# Altium project flight_controller.PrjPcb
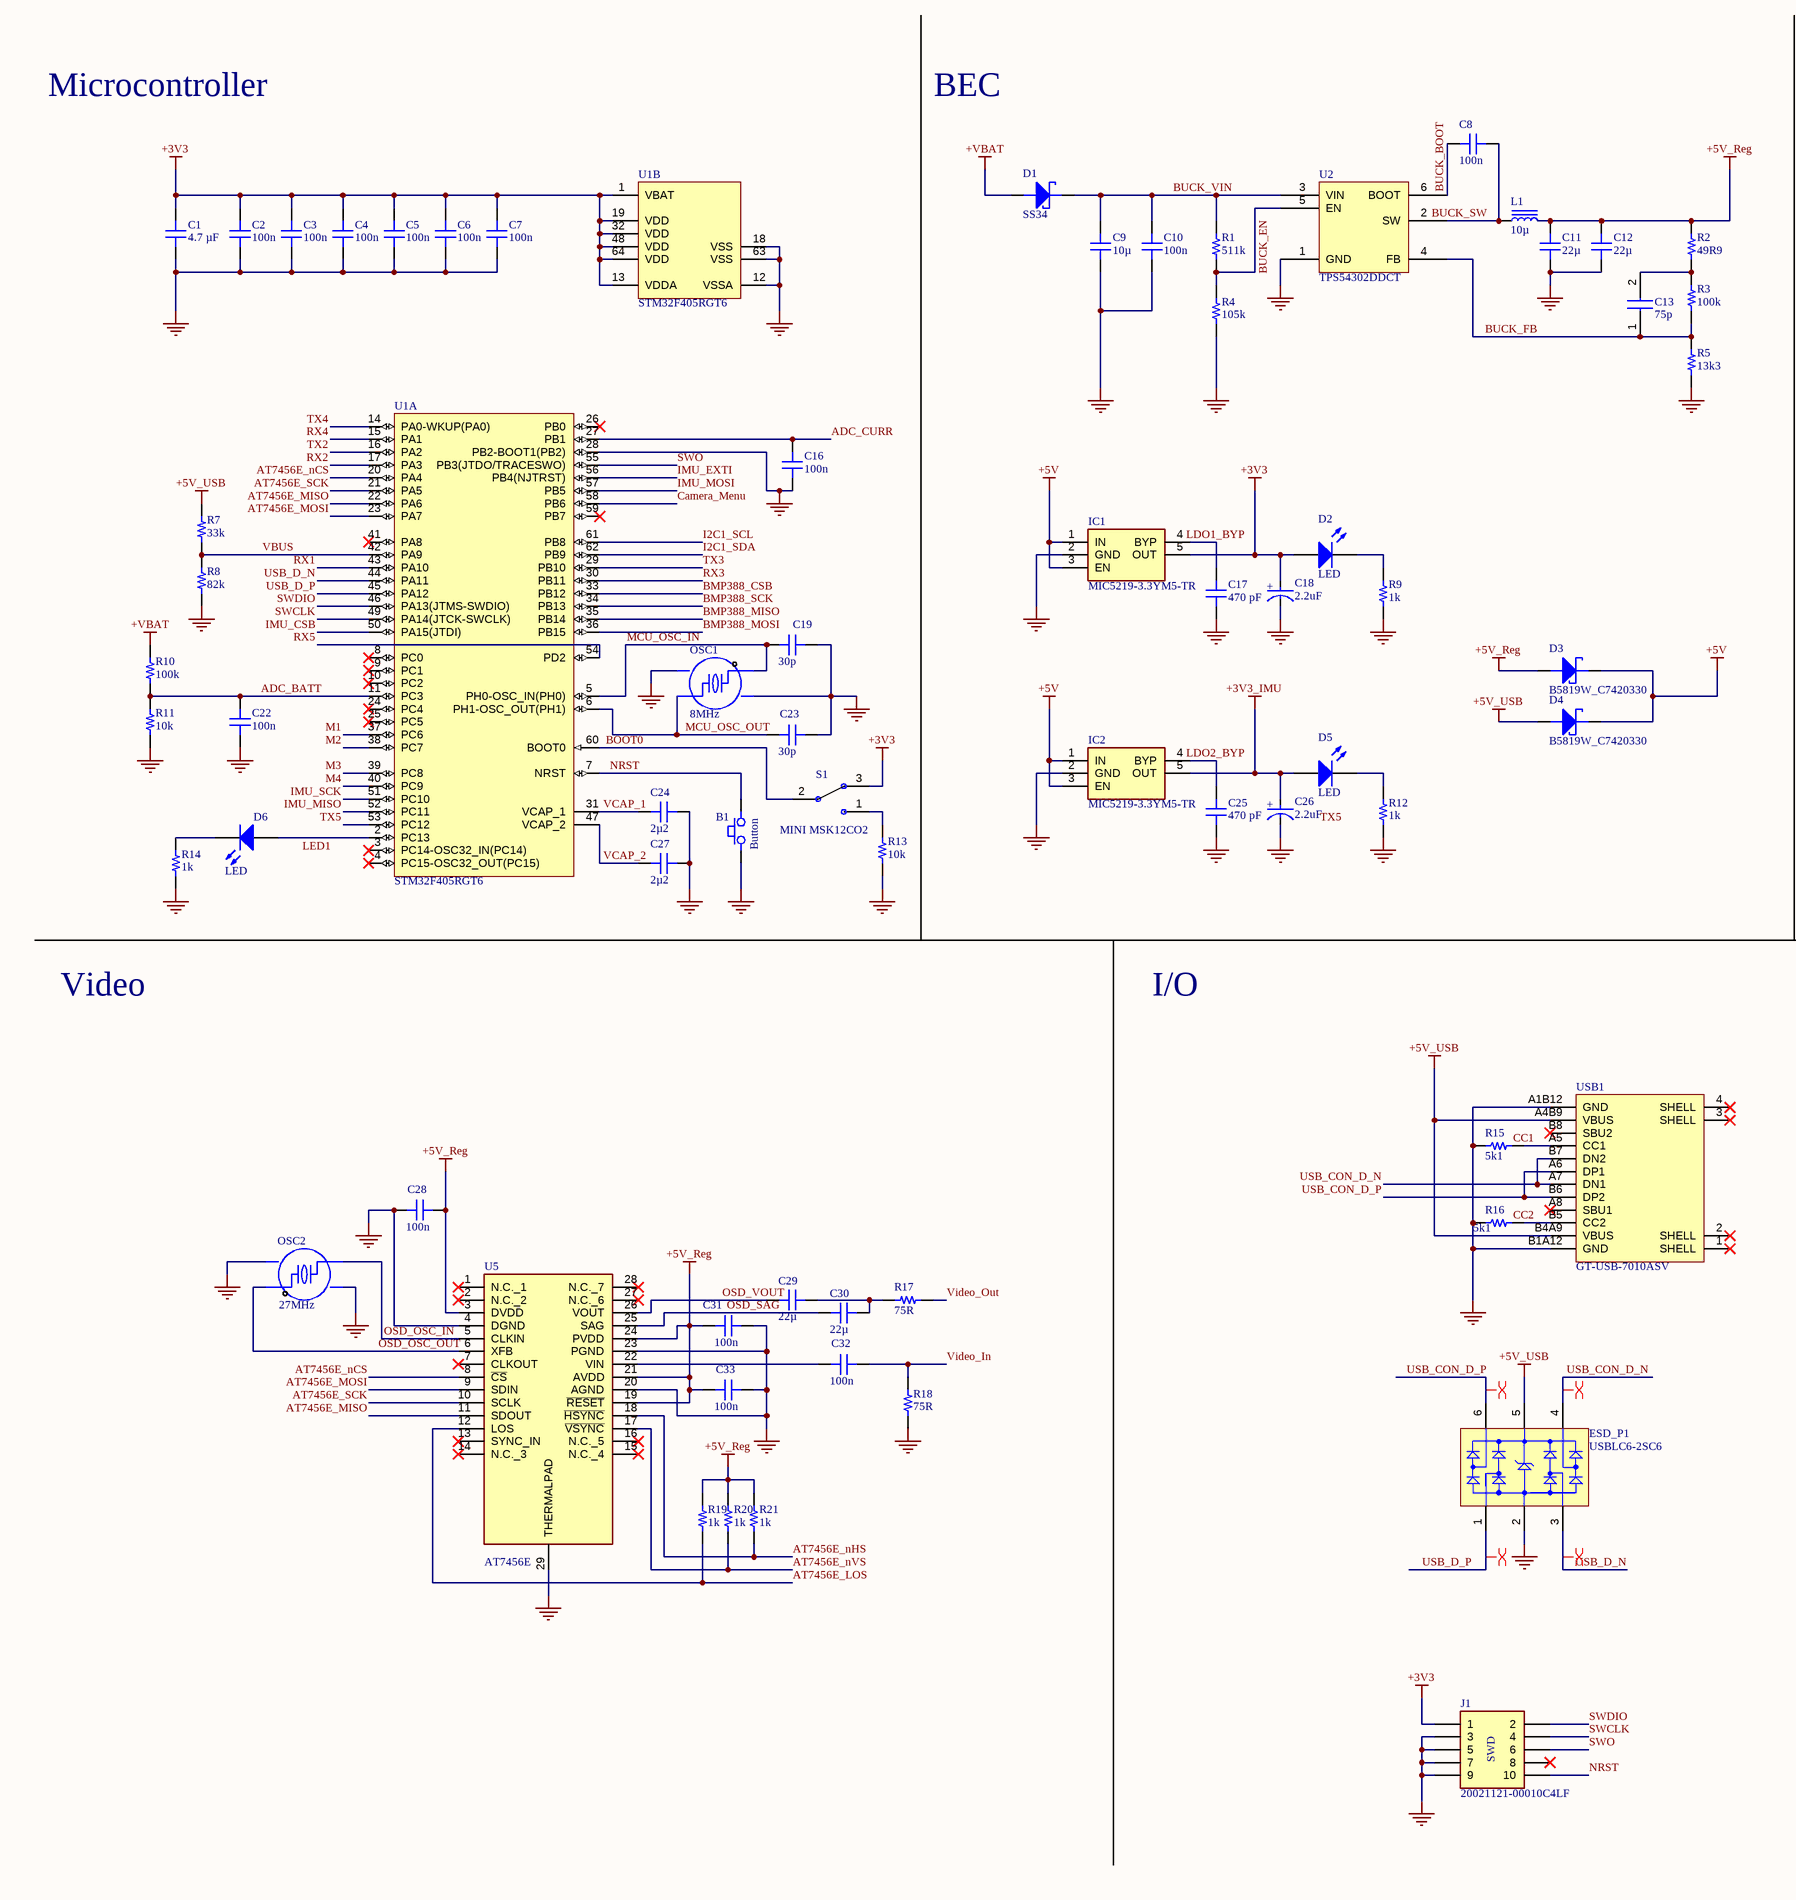
[diagram p0: flight_controller.SchDoc, left]
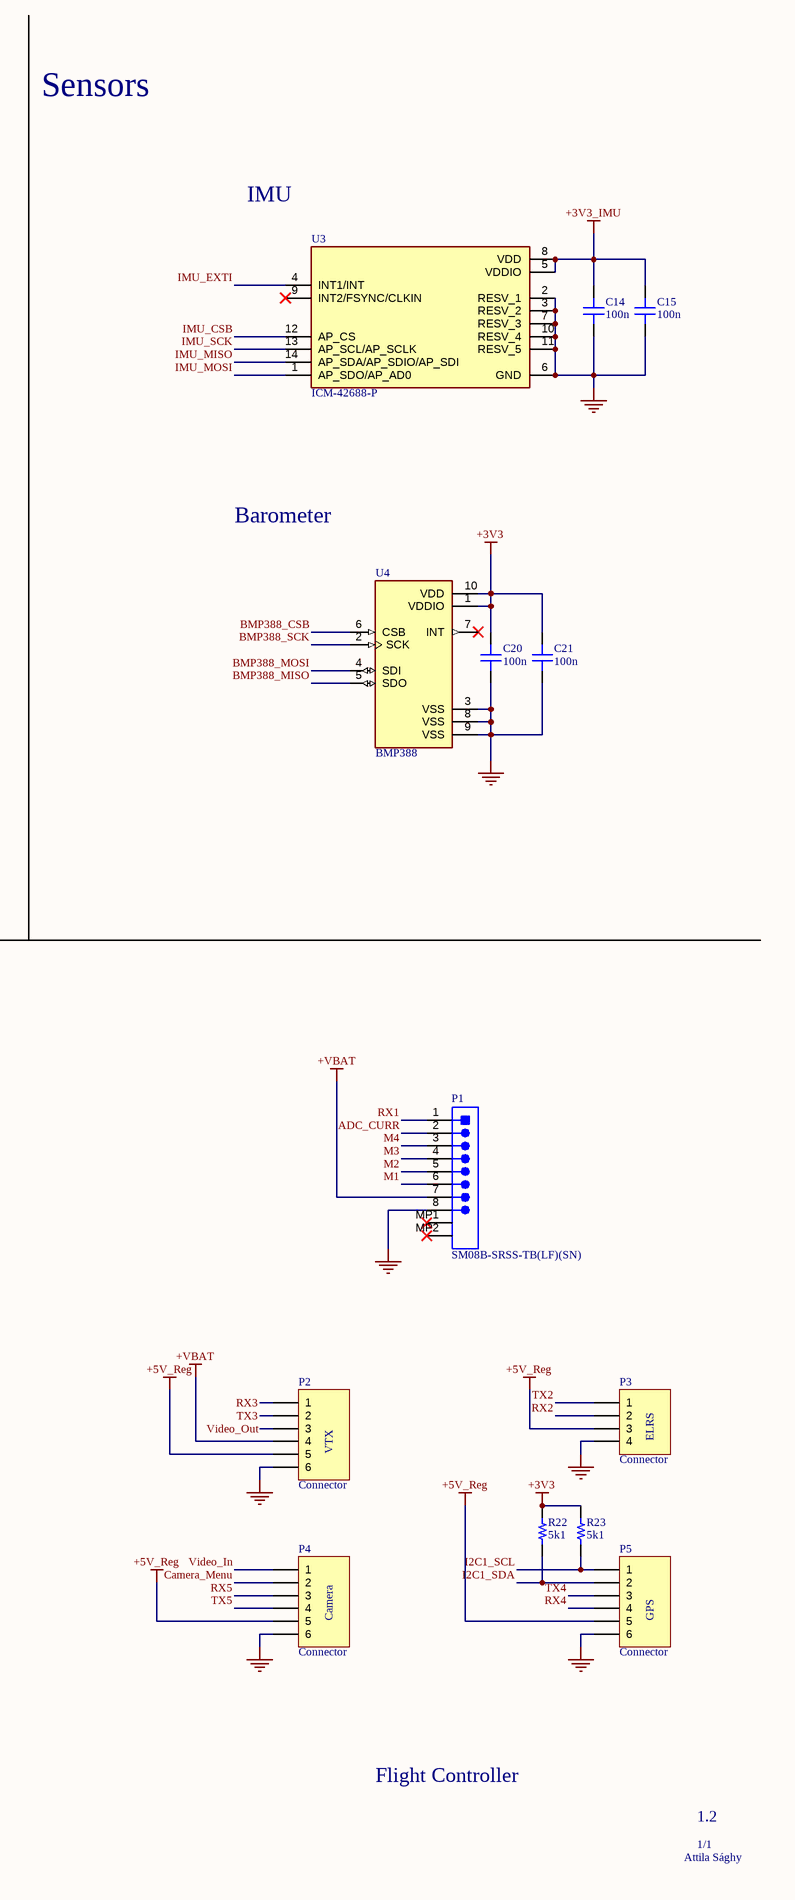
[diagram p1: flight_controller.SchDoc, right]
1 sheet, 81 parts. Net scope: global (net labels, ports and power ports of the same name join across sheets).
Board file: flight_controller.PcbDoc

## Sheet flight_controller.SchDoc
size C; SheetNumber: 1; SheetTotal: 1

### Parts
B1  Button  [TS24CA]
C1  4.7 µF  [CAP 0805_2012]
C2  Capacitance: 100n  [CAP 0603_1608]  (hidden comment: 0.1 µF)
C3  Capacitance: 100n  [CAP 0603_1608]  (hidden comment: 0.1 µF)
C4  Capacitance: 100n  [CAP 0603_1608]  (hidden comment: 0.1 µF)
C5  Capacitance: 100n  [CAP 0603_1608]  (hidden comment: 0.1 µF)
C6  Capacitance: 100n  [CAP 0603_1608]  (hidden comment: 0.1 µF)
C7  Capacitance: 100n  [CAP 0603_1608]  (hidden comment: 0.1 µF)
C8  Capacitance: 100n  [CAP 0603_1608]  (hidden comment: 0.1 µF)
C9  Capacitance: 10µ  [MURATA GRM21B 0805_2012]  (hidden comment: 10 µF)
C10  Capacitance: 100n  [CAP 0603_1608]  (hidden comment: 0.1 µF)
C11  Capacitance: 22µ  [CAP 0805_2012]  (hidden comment: 22 µF)
C12  Capacitance: 22µ  [CAP 0805_2012]  (hidden comment: 22 µF)
C13  75p  [CAPC1608X90N]
C14  Capacitance: 100n  [CAP 0603_1608]  (hidden comment: 0.1 µF)
C15  Capacitance: 100n  [CAP 0603_1608]  (hidden comment: 0.1 µF)
C16  Capacitance: 100n  [CAP 0603_1608]  (hidden comment: 0.1 µF)
C17  Capacitance: 470 pF  [CAP 0805_2012]  (hidden comment: 10 µF)
C18  2.2uF  [FP-TAJA-MFG]
C19  Capacitance: 30p  [CAP 0603_1608]  (hidden comment: 0.1 µF)
C20  Capacitance: 100n  [CAP 0603_1608]  (hidden comment: 0.1 µF)
C21  Capacitance: 100n  [CAP 0603_1608]  (hidden comment: 0.1 µF)
C22  Capacitance: 100n  [CAP 0603_1608]  (hidden comment: 0.1 µF)
C23  Capacitance: 30p  [CAP 0603_1608]  (hidden comment: 0.1 µF)
C24  Capacitance: 2µ2  [CAP 0805_2012]  (hidden comment: 2.2 µF)
C25  Capacitance: 470 pF  [CAP 0805_2012]  (hidden comment: 10 µF)
C26  2.2uF  [FP-TAJA-MFG]
C27  Capacitance: 2µ2  [CAP 0805_2012]  (hidden comment: 2.2 µF)
C28  Capacitance: 100n  [CAP 0603_1608]  (hidden comment: 0.1 µF)
C29  Capacitance: 22µ  [CAP 0805_2012]  (hidden comment: 22 µF)
C30  Capacitance: 22µ  [CAP 0805_2012]  (hidden comment: 22 µF)
C31  Capacitance: 100n  [CAP 0603_1608]  (hidden comment: 0.1 µF)
C32  Capacitance: 100n  [CAP 0603_1608]  (hidden comment: 0.1 µF)
C33  Capacitance: 100n  [CAP 0603_1608]  (hidden comment: 0.1 µF)
D1  SS34  [FP_SMA]
D2  LED  [FP_0805_LED_GREEN]
D3  B5819W_C7420330  [SOD-123]
D4  B5819W_C7420330  [SOD-123]
D5  LED  [FP_0805_LED_GREEN]
D6  LED  [FP_0805_LED_GREEN]
ESD_P1  USBLC6-2SC6  [STM-SOT23-6L_V]
IC1  MIC5219-3.3YM5-TR  [SOT95P280X145-5N]
IC2  MIC5219-3.3YM5-TR  [SOT95P280X145-5N]
J1  20021121-00010C4LF  [2002112100010C4LF]
L1  10µ  [BOURNS SRP5030T]
OSC1  8MHz  [CRYSTAL-SMD_4P-L3.2-W2.5-BL]
OSC2  27MHz  [X322527MSB4SI]
P1  SM08B-SRSS-TB(LF)(SN)  [JST-SM08B-SRSS-TB_V]
P2  Connector  [PAD_6]
P3  Connector  [PAD_4]
P4  Connector  [PAD_6]
P5  Connector  [PAD_6]
R1  511k  [YAGEO RES 0603_1608]
R2  49R9  [YAGEO RES 0603_1608]
R3  100k  [YAGEO RES 0603_1608]
R4  105k  [YAGEO RES 0603_1608]
R5  13k3  [YAGEO RES 0603_1608]
R7  33k  [YAGEO RES 0603_1608]
R8  82k  [YAGEO RES 0603_1608]
R9  1k  [YAGEO RES 0603_1608]
R10  value 100k  [YAGEO RES 0603_1608]  (hidden comment: 33k)
R11  value 10k  [YAGEO RES 0603_1608]  (hidden comment: 6.8k)
R12  1k  [YAGEO RES 0603_1608]
R13  value 10k  [YAGEO RES 0603_1608]  (hidden comment: 6.8k)
R14  1k  [YAGEO RES 0603_1608]
R15  5k1  [YAGEO RES 0603_1608]
R16  5k1  [YAGEO RES 0603_1608]
R17  75R  [YAGEO RES 0603_1608]
R18  75R  [YAGEO RES 0603_1608]
R19  1k  [YAGEO RES 0603_1608]
R20  1k  [YAGEO RES 0603_1608]
R21  1k  [YAGEO RES 0603_1608]
R22  5k1  [YAGEO RES 0603_1608]
R23  5k1  [YAGEO RES 0603_1608]
S1  MINI MSK12CO2  [SW-SMD_MSK12CO2]
U1  STM32F405RGT6  [STM-LQFP64_M]  (parts A,B of 2)
U2  TPS54302DDCT  [TI SOT-23-6 DDC]
U3  ICM-42688-P  [IIM42352]
U4  BMP388  [PQFN50P200X200X80-10N]
U5  AT7456E  [SOP65P640X120-29N]
USB1  GT-USB-7010ASV  [USB-C-SMD_G-SWITCH_GT-USB-7010ASV]

### Nets
+3V3: C1.2 C2.2 C3.2 C4.2 C5.2 C6.2 C7.2 C18.2(A) C20.1 C21.1 D2.1(A) IC1.5(OUT) J1.1 R22.1 R23.1 S1.3 U1.1(VBAT) U1.13(VDDA) U1.19(VDD) U1.32(VDD) U1.48(VDD) U1.64(VDD) U4.1(VDDIO) U4.10(VDD)
+3V3_IMU: C14.1 C15.1 C26.2(A) D5.1(A) IC2.5(OUT) U3.5(VDDIO) U3.8(VDD)
+5V: D3.2(CATHODE) D4.2(CATHODE) IC1.1(IN) IC1.3(EN) IC2.1(IN) IC2.3(EN)
+5V_Reg: C11.2 C12.2 C28.2 C31.1 C33.1 D3.1(ANODE) L1.2 P2.5 P3.3 P4.5 P5.5 R2.2 R19.2 R20.2 R21.2 U5.3(DVDD) U5.19(~{RESET}) U5.21(AVDD) U5.24(PVDD)
+5V_USB: D4.1(ANODE) ESD_P1.5(VBUS) R7.2 USB1.A4B9(VBUS) USB1.B4A9(VBUS)
+VBAT: D1.1(ANODE) P1.7 P2.4 R10.2
GND: B1.1 C1.1 C2.1 C3.1 C4.1 C5.1 C6.1 C7.1 C9.1 C10.2 C11.1 C12.1 C14.2 C15.2 C16.1 C17.1 C18.1(C) C19.1 C20.2 C21.2 C22.1 C23.1 C24.1 C25.1 C26.1(C) C27.1 C28.1 C31.2 C33.2 ESD_P1.2(GND) IC1.2(GND) IC2.2(GND) J1.3 J1.5 J1.7 J1.9 OSC1.2(GND) OSC1.4(GND) OSC2.2(GND) OSC2.4(GND) P1.8 P2.6 P3.4 P4.6 P5.6 R4.1 R5.1 R8.1 R9.1 R11.1 R12.1 R13.1 R14.1 R15.2 R16.2 R18.2 U1.12(VSSA) U1.18(VSS) U1.28(PB2-BOOT1(PB2)) U1.63(VSS) U2.1(GND) U3.2(RESV_1) U3.3(RESV_2) U3.6(GND) U3.7(RESV_3) U3.10(RESV_4) U3.11(RESV_5) U4.3(VSS) U4.8(VSS) U4.9(VSS) U5.4(DGND) U5.20(AGND) U5.23(PGND) U5.29(THERMALPAD) USB1.A1B12(GND) USB1.B1A12(GND)
ADC_BATT: C22.2 R10.1 R11.2 U1.11(PC3)
ADC_CURR: C16.2 P1.2 U1.27(PB1)
AT7456E_LOS: R19.1 U5.12(LOS)
AT7456E_MISO: U1.22(PA6) U5.11(SDOUT)
AT7456E_MOSI: U1.23(PA7) U5.9(SDIN)
AT7456E_nCS: U1.20(PA4) U5.8(~{CS})
AT7456E_nHS: R21.1 U5.18(~{HSYNC})
AT7456E_nVS: R20.1 U5.17(~{VSYNC})
AT7456E_SCK: U1.21(PA5) U5.10(SCLK)
BMP388_CSB: U1.33(PB12) U4.6(CSB)
BMP388_MISO: U1.35(PB14) U4.5(SDO)
BMP388_MOSI: U1.36(PB15) U4.4(SDI)
BMP388_SCK: U1.34(PB13) U4.2(SCK)
BOOT0: S1.2 U1.60(BOOT0)
BUCK_BOOT: C8.1 U2.6(BOOT)
BUCK_EN: R1.1 R4.2 U2.5(EN)
BUCK_FB: C13.1 R3.1 R5.2 U2.4(FB)
BUCK_SW: C8.2 L1.1 U2.2(SW)
BUCK_VIN: C9.2 C10.1 D1.2(CATHODE) R1.2 U2.3(VIN)
Camera_Menu: P4.2 U1.58(PB6)
CC1: R15.1 USB1.A5(CC1)
CC2: R16.1 USB1.B5(CC2)
I2C1_SCL: P5.1 R23.2 U1.61(PB8)
I2C1_SDA: P5.2 R22.2 U1.62(PB9)
IMU_CSB: U1.50(PA15(JTDI)) U3.12(AP_CS)
IMU_EXTI: U1.56(PB4(NJTRST)) U3.4(INT1/INT)
IMU_MISO: U1.52(PC11) U3.14(AP_SDA/AP_SDIO/AP_SDI)
IMU_MOSI: U1.57(PB5) U3.1(AP_SDO/AP_AD0)
IMU_SCK: U1.51(PC10) U3.13(AP_SCL/AP_SCLK)
LDO1_BYP: C17.2 IC1.4(BYP)
LDO2_BYP: C25.2 IC2.4(BYP)
LED1: D6.1(A) U1.2(PC13)
M1: P1.6 U1.37(PC6)
M2: P1.5 U1.38(PC7)
M3: P1.4 U1.39(PC8)
M4: P1.3 U1.40(PC9)
MCU_OSC_IN: C19.2 OSC1.1 U1.5(PH0-OSC_IN(PH0))
MCU_OSC_OUT: C23.2 OSC1.3 U1.6(PH1-OSC_OUT(PH1))
NRST: B1.2 J1.10 U1.7(NRST)
OSD_OSC_IN: OSC2.3 U5.5(CLKIN)
OSD_OSC_OUT: OSC2.1 U5.6(XFB)
OSD_SAG: C30.2 U5.25(SAG)
OSD_VOUT: C29.2 U5.26(VOUT)
RX1: P1.1 U1.43(PA10)
RX2: P3.2 U1.17(PA3)
RX3: P2.1 U1.30(PB11)
RX4: P5.4 U1.15(PA1)
RX5: P4.3 U1.54(PD2)
SWCLK: J1.4 U1.49(PA14(JTCK-SWCLK))
SWDIO: J1.2 U1.46(PA13(JTMS-SWDIO))
SWO: J1.6 U1.55(PB3(JTDO/TRACESWO))
TX2: P3.1 U1.16(PA2)
TX3: P2.2 U1.29(PB10)
TX4: P5.3 U1.14(PA0-WKUP(PA0))
TX5: P4.4 U1.53(PC12)
USB_CON_D_N: ESD_P1.4(I/O_3) USB1.A7(DN1) USB1.B7(DN2)
USB_CON_D_P: ESD_P1.6(I/O_4) USB1.A6(DP1) USB1.B6(DP2)
USB_D_N: ESD_P1.3(I/O_2) U1.44(PA11)
USB_D_P: ESD_P1.1(I/O_1) U1.45(PA12)
VBUS: R7.1 R8.2 U1.42(PA9)
VCAP_1: C24.2 U1.31(VCAP_1)
VCAP_2: C27.2 U1.47(VCAP_2)
Video_In: C32.2 P4.1 R18.1
Video_Out: P2.3 R17.1
NetC13_2: C13.2 R2.1 R3.2
NetC29_1: C29.1 C30.1 R17.2
NetC32_1: C32.1 U5.22(VIN)
NetD2_2: D2.2(K) R9.2
NetD5_2: D5.2(K) R12.2
NetD6_2: D6.2(K) R14.2
NetR13_2: R13.2 S1.1

Not connected (* = marked no-connect by the designer): J1 8*; P1 MP1* MP2*; U1 3(PC14-OSC32_IN(PC14))* 4(PC15-OSC32_OUT(PC15))* 8(PC0)* 9(PC1)* 10(PC2)* 24(PC4)* 25(PC5)* 26(PB0)* 41(PA8)* 59(PB7)*; U3 9(INT2/FSYNC/CLKIN)*; U4 7(INT)*; U5 1(N.C._1)* 2(N.C._2)* 7(CLKOUT)* 13(SYNC_IN)* 14(N.C._3)* 15(N.C._4)* 16(N.C._5)* 27(N.C._6)* 28(N.C._7)*; USB1 1(SHELL)* 2(SHELL)* 3(SHELL)* 4(SHELL)* A8(SBU1)* B8(SBU2)*

### Layout directives
differential pair: USB_CON_D_N, USB_CON_D_P, USB_D_N, USB_D_P

### Notes on the sheet
- Microcontroller
- BEC
- Sensors
- IMU
- Barometer
- Video
- I/O
- (near P2) VTX
- (near P3) ELRS
- (near P4) Camera
- (near P5) GPS
- (near J1) SWD
- Flight Controller
- Attila Sághy
- 1.2
- 1/1
- Labels drawn without touching a wire or pin: TX5
- (in symbol CMP-04424-000432-1) +

### Library data of the parts
B1 = Button 2P: Push button
C1 = CL21A475KAQNNNE: CAP CER 4.7UF 25V X5R 0805; manufacturer: Samsung Electro-Mechanics; Tolerance: ±10%; Part Number: CL21A475KAQNNNE; Capacitance: 4.7 µF; Applications: General Purpose; componentlink1description: Datasheet; componentlink1url: http://www.samsungsem.com/kr/support/product-search/mlcc/CL21A475KAQNNNE.jsp; componentlink2description: DigiKey Link; componentlink2url: https://www.digikey.com/en/products/detail/samsung-electro-mechanics/CL21A475KAQNNNE/3886902; Device Package: 0805 (2012 Metric); lastupdated: 09/02/2024 20:15:37; Lifecycle Status: Active; Minimum Order: 1; Mounting Type: Surface Mount, MLCC; Operating Temperature: -55°C ~ 85°C; Package / Case: 0805 (2012 Metric); packaging: TapeAndReel; partid: 14321; Part Status: Active; price: 0.01; series: CL; Size / Dimension: 0.079" L x 0.049" W (2.00mm x 1.25mm); Supplier 1: DigiKey; Supplier Part Number 1: 1276-1244-1-ND; Temperature Coefficient: X5R; Thickness (Max): 0.055" (1.40mm); value: 4.7 µF; Voltage - Rated: 25V
C2-C8 C10 C14-C16 C19-C23 C28 C31-C33 = CL10B104KB8NNNC: CAP CER 0.1UF 50V X7R 0603; manufacturer: Samsung Electro-Mechanics; Tolerance: ±10%; Part Number: CL10B104KB8NNNC; Applications: General Purpose; componentlink1description: Datasheet; componentlink1url: http://www.samsungsem.com/kr/support/product-search/mlcc/CL10B104KB8NNNC.jsp; componentlink2description: DigiKey Link; componentlink2url: https://www.digikey.com/en/products/detail/samsung-electro-mechanics/CL10B104KB8NNNC/3886658; Device Package: 0603 (1608 Metric); lastupdated: 09/02/2024 20:10:20; Lifecycle Status: Active; Minimum Order: 1; Mounting Type: Surface Mount, MLCC; Operating Temperature: -55°C ~ 125°C; Package / Case: 0603 (1608 Metric); packaging: TapeAndReel; partid: 9788; Part Status: Active; price: 0.01; series: CL; Size / Dimension: 0.063" L x 0.031" W (1.60mm x 0.80mm); Supplier 1: DigiKey; Supplier Part Number 1: 1276-1000-1-ND; Temperature Coefficient: X7R; Thickness (Max): 0.035" (0.90mm); value: 0.1 µF; Voltage - Rated: 50V
C9 = GRM21BR61H106KE43L: CAP CER 10UF 50V X5R 0805; manufacturer: Murata Electronics; Tolerance: ±10%; Part Number: GRM21BR61H106KE43L; Applications: Mobile Devices Only; componentlink1description: Datasheet; componentlink1url: https://search.murata.co.jp/Ceramy/image/img/A01X/G101/ENG/GRM21BR61H106KE43-01A.pdf; componentlink2description: DigiKey Link; componentlink2url: https://www.digikey.com/en/products/detail/murata-electronics/GRM21BR61H106KE43L/10326316; Device Package: 0805 (2012 Metric); lastupdated: 27/08/2024 09:29:56; Lifecycle Status: Active; Minimum Order: 1; Mounting Type: Surface Mount, MLCC; Operating Temperature: -55°C ~ 85°C; Package / Case: 0805 (2012 Metric); packaging: TapeAndReel; partid: 39284; Part Status: Active; price: 0.05; series: GRM; Size / Dimension: 0.079" L x 0.049" W (2.00mm x 1.25mm); Supplier 1: DigiKey; Supplier Part Number 1: 490-18663-1-ND; Temperature Coefficient: X5R; Thickness (Max): 0.057" (1.45mm); VALUE: 10 µF; Voltage - Rated: 50V
C11 C12 C29 C30 = CL21A226KOQNNNE: CAP CER 22UF 16V X5R 0805; manufacturer: Samsung Electro-Mechanics; Tolerance: ±10%; Part Number: CL21A226KOQNNNE; Applications: General Purpose; componentlink1description: Datasheet; componentlink1url: http://www.samsungsem.com/kr/support/library/product-catalog/mlcc.jsp; componentlink2description: DigiKey Link; componentlink2url: https://www.digikey.com/en/products/detail/samsung-electro-mechanics/CL21A226KOQNNNE/5961010; Device Package: 0805 (2012 Metric); lastupdated: 09/02/2024 20:16:07; Lifecycle Status: Active; Minimum Order: 1; Mounting Type: Surface Mount, MLCC; Operating Temperature: -55°C ~ 85°C; Package / Case: 0805 (2012 Metric); packaging: TapeAndReel; partid: 3004; Part Status: Active; price: 0.06; series: CL; Size / Dimension: 0.079" L x 0.049" W (2.00mm x 1.25mm); Supplier 1: DigiKey; Supplier Part Number 1: 1276-6526-1-ND; Temperature Coefficient: X5R; Thickness (Max): 0.055" (1.40mm); value: 22 µF; Voltage - Rated: 16V
C13 = 0603CG750J500NT: Capacitor; Manufacturer_Name: FH(Guangdong Fenghua Advanced Tech); Datasheet Link: https://datasheet.lcsc.com/lcsc/1811061811_FH--Guangdong-Fenghua-Advanced-Tech-0603CG750J500NT_C1681.pdf; Height: 0.9mm; Manufacturer_Part_Number: 0603CG750J500NT
C17 C25 = CL10B471KB8NNNC: CAP CER 470PF 50V X7R 0603; manufacturer: Samsung Electro-Mechanics; Tolerance: ±10%; Part Number: CL10B471KB8NNNC; Applications: General Purpose; componentlink1description: Datasheet; componentlink1url: http://www.samsungsem.com/kr/support/product-search/mlcc/CL10B471KB8NNNC.jsp; componentlink2description: DigiKey Link; componentlink2url: https://www.digikey.com/en/products/detail/samsung-electro-mechanics/CL10B471KB8NNNC/3886752; Device Package: 0603 (1608 Metric); lastupdated: 09/02/2024 20:10:20; Lifecycle Status: Active; Minimum Order: 1; Mounting Type: Surface Mount, MLCC; Operating Temperature: -55°C ~ 125°C; Package / Case: 0603 (1608 Metric); packaging: TapeAndReel; partid: 9822; Part Status: Active; price: 0.01; series: CL; Size / Dimension: 0.063" L x 0.031" W (1.60mm x 0.80mm); Supplier 1: DigiKey; Supplier Part Number 1: 1276-1094-1-ND; Temperature Coefficient: X7R; Thickness (Max): 0.035" (0.90mm); value: 470 pF; Voltage - Rated: 50V
C18 C26 = CMP-04424-000432-1: TAJA225K016RNJ 2.2uF 16V  ±10% 6.5Ω 1206  SMD Tantalum Capacitor; Polarity: Polar; Leakage Current: 500nA; Dissipation Factor: 6%; ESR (Equivalent Series Resistance): 6.5R; Q Factor: 6; Series: TAJ; Number of Pins: 2; Termination: SMD/SMT; Construction: Flat; Min Operating Temperature: -55°C; Capacitance: 2.2uF; Voltage Rating: 16V; Dielectric Material: Tantalum; Radiation Hardening: No; Package Quantity: 1; Depth: 1.6mm; Features: General Purpose; Max Operating Temperature: 125°C; Height: 1.6mm; Height - Seated (Max): 0.071inch; Tolerance: 10%; Voltage Rating (DC): 16V; Width: 1.6mm; Mount: Surface Mount; Packaging: Tape and Reel; Lead Free: Lead Free; RoHS Compliant: Yes; Length: 3.2mm; Case/Package: 1206; REACH SVHC: No SVHC; Case Code (Metric): 3216; Case Code (Imperial): 1206; Voltage: 16V
C24 C27 = CL21B225KAFNNNE: CAP CER 2.2UF 25V X7R 0805; manufacturer: Samsung Electro-Mechanics; Tolerance: ±10%; Part Number: CL21B225KAFNNNE; Applications: General Purpose; componentlink1description: Datasheet; componentlink1url: http://www.samsungsem.com/kr/support/product-search/mlcc/CL21B225KAFNNNE.jsp; componentlink2description: DigiKey Link; componentlink2url: https://www.digikey.com/en/products/detail/samsung-electro-mechanics/CL21B225KAFNNNE/3888612; Device Package: 0805 (2012 Metric); lastupdated: 09/02/2024 20:15:21; Lifecycle Status: Active; Minimum Order: 1; Mounting Type: Surface Mount, MLCC; Operating Temperature: -55°C ~ 125°C; Package / Case: 0805 (2012 Metric); packaging: TapeAndReel; partid: 17958; Part Status: Active; price: 0.02; series: CL; Size / Dimension: 0.079" L x 0.049" W (2.00mm x 1.25mm); Supplier 1: DigiKey; Supplier Part Number 1: 1276-2954-1-ND; Temperature Coefficient: X7R; Thickness (Max): 0.053" (1.35mm); value: 2.2 µF; Voltage - Rated: 25V
D1 = SCHOTTKY: Schottky diode
D2 D5 D6 = LED: Typical RED GaAs LED; pin to pad: 1>A 2>K
D3 D4 = B5819W_C7420330: Diode
ESD_P1 = CMP-2000-05378-1: Very low capacitance ESD protection, 3.5 pF, -40 to 125 degC, 6-Pin SOT23, RoHS, Tape and Reel; Manufacturer: STMicroelectronics; Polarity: Uni-Directional; Clamping Voltage: 17V; Rad Hardened: No; Product Height (mm): 1.3mm; Leakage Current (Max): 0.15uA; Product Length (mm): 3.05mm; Number of Elements: 1; Peak Pulse Current: 5A; Configuration: Dual; Reverse Breakdown Voltage: 6V; Working Voltage (Max): 5V; Capacitance Value: 3.5pF; Suppressor Type: DiodeArrays; Product Depth (mm): 1.75mm; Test Current (It): 1mA; Package / Case: SOT-23; Operating Temperature Max Deg. C: 125C; Package Description: 6-Pin Small Outline Transistor, Body 2.925 x 1.625 mm, Pitch 0.95 mm; Package Reference: SOT23-6L; Datasheet Version: Rev. 5, 10/2011; Operating Temperature Min Deg. C: -40C; Mounting Style: SurfaceMount; Direction Type: Uni-Directional; Mounting: SurfaceMount; Pin Count: 6; Leakage Current: 0.15uA; Packaging: TapeandReel; Operating Temperature Classification: Automotive; Clamping Voltage (Max): 17V; Manufacturer URL: http://www.st.com/; Reverse Stand-off Voltage: 5V; Datasheet URL: http://www.st.com/st-web-ui/static/active/en/resource/technical/document/datasheet/CD00050750.pdf; Working Voltage: 5V; Operating Temp Range: -40Cto125C
IC1 IC2 = MIC5219-3.3YM5-TR: Integrated Circuit; Manufacturer_Name: Microchip; Datasheet Link: http://www.microchip.com/mymicrochip/filehandler.aspx?ddocname=en579712; Height: 1.45mm; Manufacturer_Part_Number: MIC5219-3.3YM5-TR; Mouser Part Number: 998-MIC5219-3.3YM5TR; Mouser Price/Stock: https://www.mouser.co.uk/ProductDetail/Microchip-Technology/MIC5219-3.3YM5-TR?qs=U6T8BxXiZAWojkIJMtSJlw%3D%3D; Arrow Part Number: MIC5219-3.3YM5-TR; Arrow Price/Stock: https://www.arrow.com/en/products/mic5219-3.3ym5-tr/microchip-technology?region=europe
J1 = 20021121-00010C4LF: Connector; Manufacturer_Name: Amphenol; Datasheet Link: https://cdn.amphenol-cs.com/media/wysiwyg/files/drawing/20021121.pdf; Height: 5.7mm; Manufacturer_Part_Number: 20021121-00010C4LF; Mouser Part Number: 649-202112100010C4LF; Mouser Price/Stock: https://www.mouser.co.uk/ProductDetail/Amphenol-FCI/20021121-00010C4LF?qs=iIVTEDlrHA1ddfCJGH4Nhg%3D%3D
L1 = SRP5030T-100M: FIXED IND 10UH 2.75A 128MOHM SMD; Manufacturer: Bourns Inc.; Current - Saturation: 3.5A; DC Resistance (DCR): 128mOhm Max; Inductance: 10 µH; Inductance Frequency - Test: 100 kHz; Material - Core: Iron Powder; Shielding: Shielded; Tolerance: ±20%; Type: Drum Core, Wirewound; Value: 10 µH; Part Number: SRP5030T-100M; ComponentLink1Description: Datasheet; ComponentLink1URL: https://www.bourns.com/docs/Product-Datasheets/SRP5030T.pdf; ComponentLink2Description: DigiKey Link; ComponentLink2URL: https://www.digikey.com/en/products/detail/bourns-inc/SRP5030T-100M/3986087; Current Rating (Amps): 2.75 A; Device Package: Nonstandard; Height - Seated (Max): 0.118" (3.00mm); LastUpdated: 03/06/2024 20:02:35; Lifecycle Status: Active; Minimum Order: 1; Mounting Type: Surface Mount; Operating Temperature: -40°C ~ 125°C; Package / Case: Nonstandard; Packaging: TapeAndReel; PartId: 9; Part Status: Active; Price: 0.59; Series: SRP5030T; Size / Dimension: 0.224" L x 0.205" W (5.70mm x 5.20mm); Supplier 1: DigiKey; Supplier Part Number 1: SRP5030T-100MCT-ND
OSC1 = 3225-8.00-20-10-10/A: Manufacturer: LIMING(利明); Add into BOM: yes; Normal temperature Frequency Tolerance: ±10ppm; Equivalent Series Resistance(ESR): 500Ω; Symbol: 3225-8.00-20-10-10/A; Device: 3225-8.00-20-10-10/A; LCSC Part Name: 8MHz ±10ppm 20pF; Supplier Part: C518156; Manufacturer Part: 3225-8.00-20-10-10/A; Supplier Footprint: SMD3225-4P; JLCPCB Part Class: Extended Part; Datasheet: https://atta.szlcsc.com/upload/public/pdf/source/20200603/C518143_C28693AFC6B5677A46756E3C75F63174.pdf; Supplier: LCSC; Convert to PCB: yes; Type: Surface Mount Crystal; Value: 8MHz; Operating Temperature: -20℃~+70℃
OSC2 = X322527MSB4SI
P1 = CMP-2000-07082-1: Male Header, Pitch 1 mm, 1 x 8 Position, Height 2.95 mm, -25 to 85 degC, RoHS, Tape and Reel; Manufacturer: JST; Style/Orientation: RightAngleHeader/Plug; Pitch: 1mm; No of Positions: 8; Manufacturer URL: http://www.jst.com/home2.html; Mounting Technology: SurfaceMount; Package Description: Male Header, Pitch 1 mm, 1 x 8 Position, Height 2.95 mm; Datasheet URL: http://www.jst-mfg.com/product/pdf/eng/eSR.pdf; Type: ShroudedHeader; Termination: Crimp; Package Reference: SM08B-SRSS-TB; Datasheet Version: 11/2010
P2 P4 P5 = Connector_6pin: 6pin connector
P3 = Connector_4pin: 4pin Connector
R1 = RC0603FR-07511KL: RES 511K OHM 1% 1/10W 0603; Manufacturer: Yageo; Power (Watts): 0.1W, 1/10W; Resistance: 511 kOhms; Temperature Coefficient: ±100ppm/°C; Part Number: RC0603FR-07511KL; Value: 511k; ComponentLink1Description: Datasheet; ComponentLink1URL: https://www.yageo.com/upload/media/product/productsearch/datasheet/rchip/PYu-RC_Group_51_RoHS_L_10.pdf; ComponentLink2Description: DigiKey Link; ComponentLink2URL: https://www.digikey.com/en/products/detail/yageo/RC0603FR-07511KL/727288; Composition: Thick Film; Device Package: 0603 (1608 Metric); Features: Moisture Resistant; Height - Seated (Max): 0.022" (0.55mm); LastUpdated: 25/07/2024 09:19:31; Lifecycle Status: Active; Minimum Order: 1; Number of Terminations: 2; Operating Temperature: -55°C ~ 155°C; Package / Case: 0603 (1608 Metric); Packaging: CutTape; PartId: 7757; Part Status: Active; Price: 0.01; Series: RC_L; Size / Dimension: 0.063" L x 0.031" W (1.60mm x 0.80mm); Supplier 1: DigiKey; Supplier Part Number 1: 311-511KHRCT-ND; Supplier Device Package: 0603; Tolerance: ±1%
R2 = RC0603FR-0749R9L: RES 49.9 OHM 1% 1/10W 0603; Manufacturer: Yageo; Power (Watts): 0.1W, 1/10W; Resistance: 49.9 Ohms; Temperature Coefficient: ±100ppm/°C; Part Number: RC0603FR-0749R9L; Value: 49R9; ComponentLink1Description: Datasheet; ComponentLink1URL: https://www.yageo.com/upload/media/product/productsearch/datasheet/rchip/PYu-RC_Group_51_RoHS_L_10.pdf; ComponentLink2Description: DigiKey Link; ComponentLink2URL: https://www.digikey.com/en/products/detail/yageo/RC0603FR-0749R9L/727264; Composition: Thick Film; Device Package: 0603 (1608 Metric); Features: Moisture Resistant; Height - Seated (Max): 0.022" (0.55mm); LastUpdated: 25/07/2024 09:19:17; Lifecycle Status: Active; Minimum Order: 1; Number of Terminations: 2; Operating Temperature: -55°C ~ 155°C; Package / Case: 0603 (1608 Metric); Packaging: CutTape; PartId: 23951; Part Status: Active; Price: 0.01; Series: RC_L; Size / Dimension: 0.063" L x 0.031" W (1.60mm x 0.80mm); Supplier 1: DigiKey; Supplier Part Number 1: 311-49.9HRCT-ND; Supplier Device Package: 0603; Tolerance: ±1%
R3 R10 = RC0603FR-07100KL: RES 100K OHM 1% 1/10W 0603; Manufacturer: Yageo; Power (Watts): 0.1W, 1/10W; Resistance: 100 kOhms; Temperature Coefficient: ±100ppm/°C; Part Number: RC0603FR-07100KL; ComponentLink1Description: Datasheet; ComponentLink1URL: https://www.yageo.com/upload/media/product/productsearch/datasheet/rchip/PYu-RC_Group_51_RoHS_L_10.pdf; ComponentLink2Description: DigiKey Link; ComponentLink2URL: https://www.digikey.com/en/products/detail/yageo/RC0603FR-07100KL/726889; Composition: Thick Film; Device Package: 0603 (1608 Metric); Features: Moisture Resistant; Height - Seated (Max): 0.022" (0.55mm); LastUpdated: 25/07/2024 09:19:17; Lifecycle Status: Active; Minimum Order: 1; Number of Terminations: 2; Operating Temperature: -55°C ~ 155°C; Package / Case: 0603 (1608 Metric); Packaging: CutTape; PartId: 23948; Part Status: Active; Price: 0.01; Series: RC_L; Size / Dimension: 0.063" L x 0.031" W (1.60mm x 0.80mm); Supplier 1: DigiKey; Supplier Part Number 1: 311-100KHRCT-ND; Supplier Device Package: 0603; Tolerance: ±1%
  R3: Value: 100k
R4 = RC0603FR-07105KL: RES 105K OHM 1% 1/10W 0603; Manufacturer: Yageo; Power (Watts): 0.1W, 1/10W; Resistance: 105 kOhms; Temperature Coefficient: ±100ppm/°C; Part Number: RC0603FR-07105KL; Value: 105k; ComponentLink1Description: Datasheet; ComponentLink1URL: https://www.yageo.com/upload/media/product/productsearch/datasheet/rchip/PYu-RC_Group_51_RoHS_L_10.pdf; ComponentLink2Description: DigiKey Link; ComponentLink2URL: https://www.digikey.com/en/products/detail/yageo/RC0603FR-07105KL/726893; Composition: Thick Film; Device Package: 0603 (1608 Metric); Features: Moisture Resistant; Height - Seated (Max): 0.022" (0.55mm); LastUpdated: 25/07/2024 09:19:32; Lifecycle Status: Active; Minimum Order: 1; Number of Terminations: 2; Operating Temperature: -55°C ~ 155°C; Package / Case: 0603 (1608 Metric); Packaging: CutTape; PartId: 7511; Part Status: Active; Price: 0.01; Series: RC_L; Size / Dimension: 0.063" L x 0.031" W (1.60mm x 0.80mm); Supplier 1: DigiKey; Supplier Part Number 1: 311-105KHRCT-ND; Supplier Device Package: 0603; Tolerance: ±1%
R5 = RC0603FR-0713K3L: RES 13.3K OHM 1% 1/10W 0603; Manufacturer: Yageo; Power (Watts): 0.1W, 1/10W; Resistance: 13.3 kOhms; Temperature Coefficient: ±100ppm/°C; Part Number: RC0603FR-0713K3L; Value: 13k3; ComponentLink1Description: Datasheet; ComponentLink1URL: https://www.yageo.com/upload/media/product/productsearch/datasheet/rchip/PYu-RC_Group_51_RoHS_L_10.pdf; ComponentLink2Description: DigiKey Link; ComponentLink2URL: https://www.digikey.com/en/products/detail/yageo/RC0603FR-0713K3L/726931; Composition: Thick Film; Device Package: 0603 (1608 Metric); Features: Moisture Resistant; Height - Seated (Max): 0.022" (0.55mm); LastUpdated: 25/07/2024 09:19:28; Lifecycle Status: Active; Minimum Order: 1; Number of Terminations: 2; Operating Temperature: -55°C ~ 155°C; Package / Case: 0603 (1608 Metric); Packaging: CutTape; PartId: 12236; Part Status: Active; Price: 0.01; Series: RC_L; Size / Dimension: 0.063" L x 0.031" W (1.60mm x 0.80mm); Supplier 1: DigiKey; Supplier Part Number 1: 311-13.3KHRCT-ND; Supplier Device Package: 0603; Tolerance: ±1%
R7 = RC0603FR-0733KL: RES 33K OHM 1% 1/10W 0603; Manufacturer: Yageo; Power (Watts): 0.1W, 1/10W; Resistance: 33 kOhms; Temperature Coefficient: ±100ppm/°C; Part Number: RC0603FR-0733KL; Value: 33k; ComponentLink1Description: Datasheet; ComponentLink1URL: https://www.yageo.com/upload/media/product/productsearch/datasheet/rchip/PYu-RC_Group_51_RoHS_L_10.pdf; ComponentLink2Description: DigiKey Link; ComponentLink2URL: https://www.digikey.com/en/products/detail/yageo/RC0603FR-0733KL/727159; Composition: Thick Film; Device Package: 0603 (1608 Metric); Features: Moisture Resistant; Height - Seated (Max): 0.022" (0.55mm); LastUpdated: 25/07/2024 09:19:21; Lifecycle Status: Active; Minimum Order: 1; Number of Terminations: 2; Operating Temperature: -55°C ~ 155°C; Package / Case: 0603 (1608 Metric); Packaging: CutTape; PartId: 18943; Part Status: Active; Price: 0.01; Series: RC_L; Size / Dimension: 0.063" L x 0.031" W (1.60mm x 0.80mm); Supplier 1: DigiKey; Supplier Part Number 1: 311-33.0KHRCT-ND; Supplier Device Package: 0603; Tolerance: ±1%
R8 = RC0603FR-0782KL: RES 82K OHM 1% 1/10W 0603; Manufacturer: Yageo; Power (Watts): 0.1W, 1/10W; Resistance: 82 kOhms; Temperature Coefficient: ±100ppm/°C; Part Number: RC0603FR-0782KL; Value: 82k; ComponentLink1Description: Datasheet; ComponentLink1URL: https://www.yageo.com/upload/media/product/productsearch/datasheet/rchip/PYu-RC_Group_51_RoHS_L_10.pdf; ComponentLink2Description: DigiKey Link; ComponentLink2URL: https://www.digikey.com/en/products/detail/yageo/RC0603FR-0782KL/727400; Composition: Thick Film; Device Package: 0603 (1608 Metric); Features: Moisture Resistant; Height - Seated (Max): 0.022" (0.55mm); LastUpdated: 25/07/2024 09:19:21; Lifecycle Status: Active; Minimum Order: 1; Number of Terminations: 2; Operating Temperature: -55°C ~ 155°C; Package / Case: 0603 (1608 Metric); Packaging: CutTape; PartId: 19081; Part Status: Active; Price: 0.01; Series: RC_L; Size / Dimension: 0.063" L x 0.031" W (1.60mm x 0.80mm); Supplier 1: DigiKey; Supplier Part Number 1: 311-82.0KHRCT-ND; Supplier Device Package: 0603; Tolerance: ±1%
R9 R12 R14 R19-R21 = RC0603FR-071KL: RES 1K OHM 1% 1/10W 0603; Manufacturer: Yageo; Power (Watts): 0.1W, 1/10W; Resistance: 1 kOhms; Temperature Coefficient: ±100ppm/°C; Part Number: RC0603FR-071KL; Value: 1k; ComponentLink1Description: Datasheet; ComponentLink1URL: https://www.yageo.com/upload/media/product/productsearch/datasheet/rchip/PYu-RC_Group_51_RoHS_L_10.pdf; ComponentLink2Description: DigiKey Link; ComponentLink2URL: https://www.digikey.com/en/products/detail/yageo/RC0603FR-071KL/726843; Composition: Thick Film; Device Package: 0603 (1608 Metric); Features: Moisture Resistant; Height - Seated (Max): 0.022" (0.55mm); LastUpdated: 25/07/2024 09:19:19; Lifecycle Status: Active; Minimum Order: 1; Number of Terminations: 2; Operating Temperature: -55°C ~ 155°C; Package / Case: 0603 (1608 Metric); Packaging: CutTape; PartId: 22600; Part Status: Active; Price: 0.01; Series: RC_L; Size / Dimension: 0.063" L x 0.031" W (1.60mm x 0.80mm); Supplier 1: DigiKey; Supplier Part Number 1: 311-1.00KHRCT-ND; Supplier Device Package: 0603; Tolerance: ±1%
R11 R13 = RC0603FR-0710KL: RES 10K OHM 1% 1/10W 0603; Manufacturer: Yageo; Power (Watts): 0.1W, 1/10W; Resistance: 10 kOhms; Temperature Coefficient: ±100ppm/°C; Part Number: RC0603FR-0710KL; ComponentLink1Description: Datasheet; ComponentLink1URL: https://www.yageo.com/upload/media/product/productsearch/datasheet/rchip/PYu-RC_Group_51_RoHS_L_10.pdf; ComponentLink2Description: DigiKey Link; ComponentLink2URL: https://www.digikey.com/en/products/detail/yageo/RC0603FR-0710KL/726880; Composition: Thick Film; Device Package: 0603 (1608 Metric); Features: Moisture Resistant; Height - Seated (Max): 0.022" (0.55mm); LastUpdated: 25/07/2024 09:19:19; Lifecycle Status: Active; Minimum Order: 1; Number of Terminations: 2; Operating Temperature: -55°C ~ 155°C; Package / Case: 0603 (1608 Metric); Packaging: CutTape; PartId: 22599; Part Status: Active; Price: 0.01; Series: RC_L; Size / Dimension: 0.063" L x 0.031" W (1.60mm x 0.80mm); Supplier 1: DigiKey; Supplier Part Number 1: 311-10.0KHRCT-ND; Supplier Device Package: 0603; Tolerance: ±1%
R15 R16 R22 R23 = RC0603FR-075K1L: RES 5.1K OHM 1% 1/10W 0603; Manufacturer: Yageo; Power (Watts): 0.1W, 1/10W; Resistance: 5.1 kOhms; Temperature Coefficient: ±100ppm/°C; Part Number: RC0603FR-075K1L; Value: 5k1; ComponentLink1Description: Datasheet; ComponentLink1URL: https://www.yageo.com/upload/media/product/productsearch/datasheet/rchip/PYu-RC_Group_51_RoHS_L_10.pdf; ComponentLink2Description: DigiKey Link; ComponentLink2URL: https://www.digikey.com/en/products/detail/yageo/RC0603FR-075K1L/727268; Composition: Thick Film; Device Package: 0603 (1608 Metric); Features: Moisture Resistant; Height - Seated (Max): 0.022" (0.55mm); LastUpdated: 25/07/2024 09:19:21; Lifecycle Status: Active; Minimum Order: 1; Number of Terminations: 2; Operating Temperature: -55°C ~ 155°C; Package / Case: 0603 (1608 Metric); Packaging: CutTape; PartId: 18982; Part Status: Active; Price: 0.01; Series: RC_L; Size / Dimension: 0.063" L x 0.031" W (1.60mm x 0.80mm); Supplier 1: DigiKey; Supplier Part Number 1: 311-5.10KHRCT-ND; Supplier Device Package: 0603; Tolerance: ±1%
R17 R18 = RC0603FR-0775RL: RES 75 OHM 1% 1/10W 0603; Manufacturer: Yageo; Power (Watts): 0.1W, 1/10W; Resistance: 75 Ohms; Temperature Coefficient: ±100ppm/°C; Part Number: RC0603FR-0775RL; Value: 75R; ComponentLink1Description: Datasheet; ComponentLink1URL: https://www.yageo.com/upload/media/product/productsearch/datasheet/rchip/PYu-RC_Group_51_RoHS_L_10.pdf; ComponentLink2Description: DigiKey Link; ComponentLink2URL: https://www.digikey.com/en/products/detail/yageo/RC0603FR-0775RL/727377; Composition: Thick Film; Device Package: 0603 (1608 Metric); Features: Moisture Resistant; Height - Seated (Max): 0.022" (0.55mm); LastUpdated: 25/07/2024 09:19:21; Lifecycle Status: Active; Minimum Order: 1; Number of Terminations: 2; Operating Temperature: -55°C ~ 155°C; Package / Case: 0603 (1608 Metric); Packaging: CutTape; PartId: 18934; Part Status: Active; Price: 0.01; Series: RC_L; Size / Dimension: 0.063" L x 0.031" W (1.60mm x 0.80mm); Supplier 1: DigiKey; Supplier Part Number 1: 311-75.0HRCT-ND; Supplier Device Package: 0603; Tolerance: ±1%
S1 = MINI MSK12CO2: Switch
U1 = CMP-0243-00019-3: ARM Cortex-M4 32-bit MCU+FPU, 210 DMIPS, 1024 kB Flash, 192 kB Internal RAM, 51 I/Os, 64-pin LQFP, -40 to 85 degC, Tray; Manufacturer: STMicroelectronics; Supply Voltage(Vcc) min (V): 1.8; Supply Voltage(Vcc) max (V): 3.6; Internal RAM Size (kB): 192; I/Os (High Current): 51; D/A Converter: 2x12-bit; FLASH Size (Prog) (kB): 1024; Operating Frequency(F) (Processor speed) (MHz): 168; ComponentLink2Description: Datasheet; PackageVersion: Rev. 4, 06/2013; DatasheetVersion: Rev. 4; Core: ARM Cortex-M4; ComponentLink2URL: http://www.st.com/st-web-ui/static/active/en/resource/technical/document/datasheet/DM00037051.pdf; PackageReference: LQFP64; Packing: Tray; ComponentLink1Description: Manufacturer URL; ComponentLink3URL: http://www.st.com/st-web-ui/static/active/en/resource/technical/document/datasheet/DM00037051.pdf; ComponentLink3Description: Package Specification; Mounting Technology: Surface Mount; ComponentLink1URL: http://www.st.com/web/en/home.html; PackageDescription: 64-Pin Low Profile Quad Flat Package, 10 x 10 mm Body, 0.5 mm Pitch; PartNumber: STM32F405RGT6
U2 = TPS54302DDCT: IC REG BUCK ADJ 3A TSOT23-6; Manufacturer: Texas Instruments; Frequency - Switching: 400kHz; Function: Step-Down; Number of Outputs: 1; Output Configuration: Positive; Output Type: Adjustable; Synchronous Rectifier: Yes; Voltage - Input (Max): 28V; Voltage - Input (Min): 4.5V; Voltage - Output (Min/Fixed): 0.596V; Part Number: TPS54302DDCT; ComponentLink1Description: Datasheet; ComponentLink1URL: http://www.ti.com/general/docs/suppproductinfo.tsp?distId=10&gotoUrl=http%3A%2F%2Fwww.ti.com%2Flit%2Fgpn%2Ftps54302; ComponentLink2Description: DigiKey Link; ComponentLink2URL: http://digikey.com/product-detail/en/texas-instruments/TPS54302DDCT/296-44542-1-ND/6128450; Current - Output: 3A; Device Package: SOT-23-6 Thin, TSOT-23-6; LastUpdated: 04/02/2020 14:31:43; Lifecycle Status: Active; Minimum Order: 1; Mounting Type: Surface Mount; Operating Temperature: -40°C ~ 125°C (TJ); Package / Case: SOT-23-6 Thin, TSOT-23-6; Packaging: TapeAndReel; Part Status: Active; Price: 1.06; Series: -; Supplier 1: DigiKey; Supplier Part Number 1: 296-44542-1-ND; Supplier Device Package: TSOT-23-6; Topology: Buck; Voltage - Output (Max): 28V
U3 = ICM-42688-P: Integrated Circuit; Manufacturer_Name: TDK; Datasheet Link: https://3cfeqx1hf82y3xcoull08ihx-wpengine.netdna-ssl.com/wp-content/uploads/2021/06/DS-000347-ICM-42688-P-v1.5.pdf; Manufacturer_Part_Number: ICM-42688-P; Mouser Part Number: 410-ICM-42688-P; Mouser Price/Stock: https://www.mouser.co.uk/ProductDetail/TDK-InvenSense/ICM-42688-P?qs=OlC7AqGiEDk8QrNAV728zw%3D%3D; Arrow Part Number: ICM-42688-P; Arrow Price/Stock: https://www.arrow.com/en/products/icm-42688-p/invensense?utm_currency=USD&region=nac
U4 = BMP388: P-Sensor SPI I2C 1, 25 Bar SMD; Package: None; Price: None; Value: *; MP: BMP388; Availability: Unavailable
U5 = AT7456E: Integrated Circuit; Manufacturer_Name: ICOF; Datasheet Link: https://datasheet.lcsc.com/szlcsc/ZHONGKEWEI-AT7456E_C82351.pdf; Height: 1.2mm; Manufacturer_Part_Number: AT7456E